# Altium schematic sheet Power.SchDoc
size A3; Author: Alptron AB; CompanyName: Alptron AB; DrawnBy: Caner Alp; Engineer: Caner Alp; Organization: Alptron AB; Address2: Vaesteas; Address4: Sweden; DocumentNumber: 3; SheetNumber: 3; SheetTotal: 5
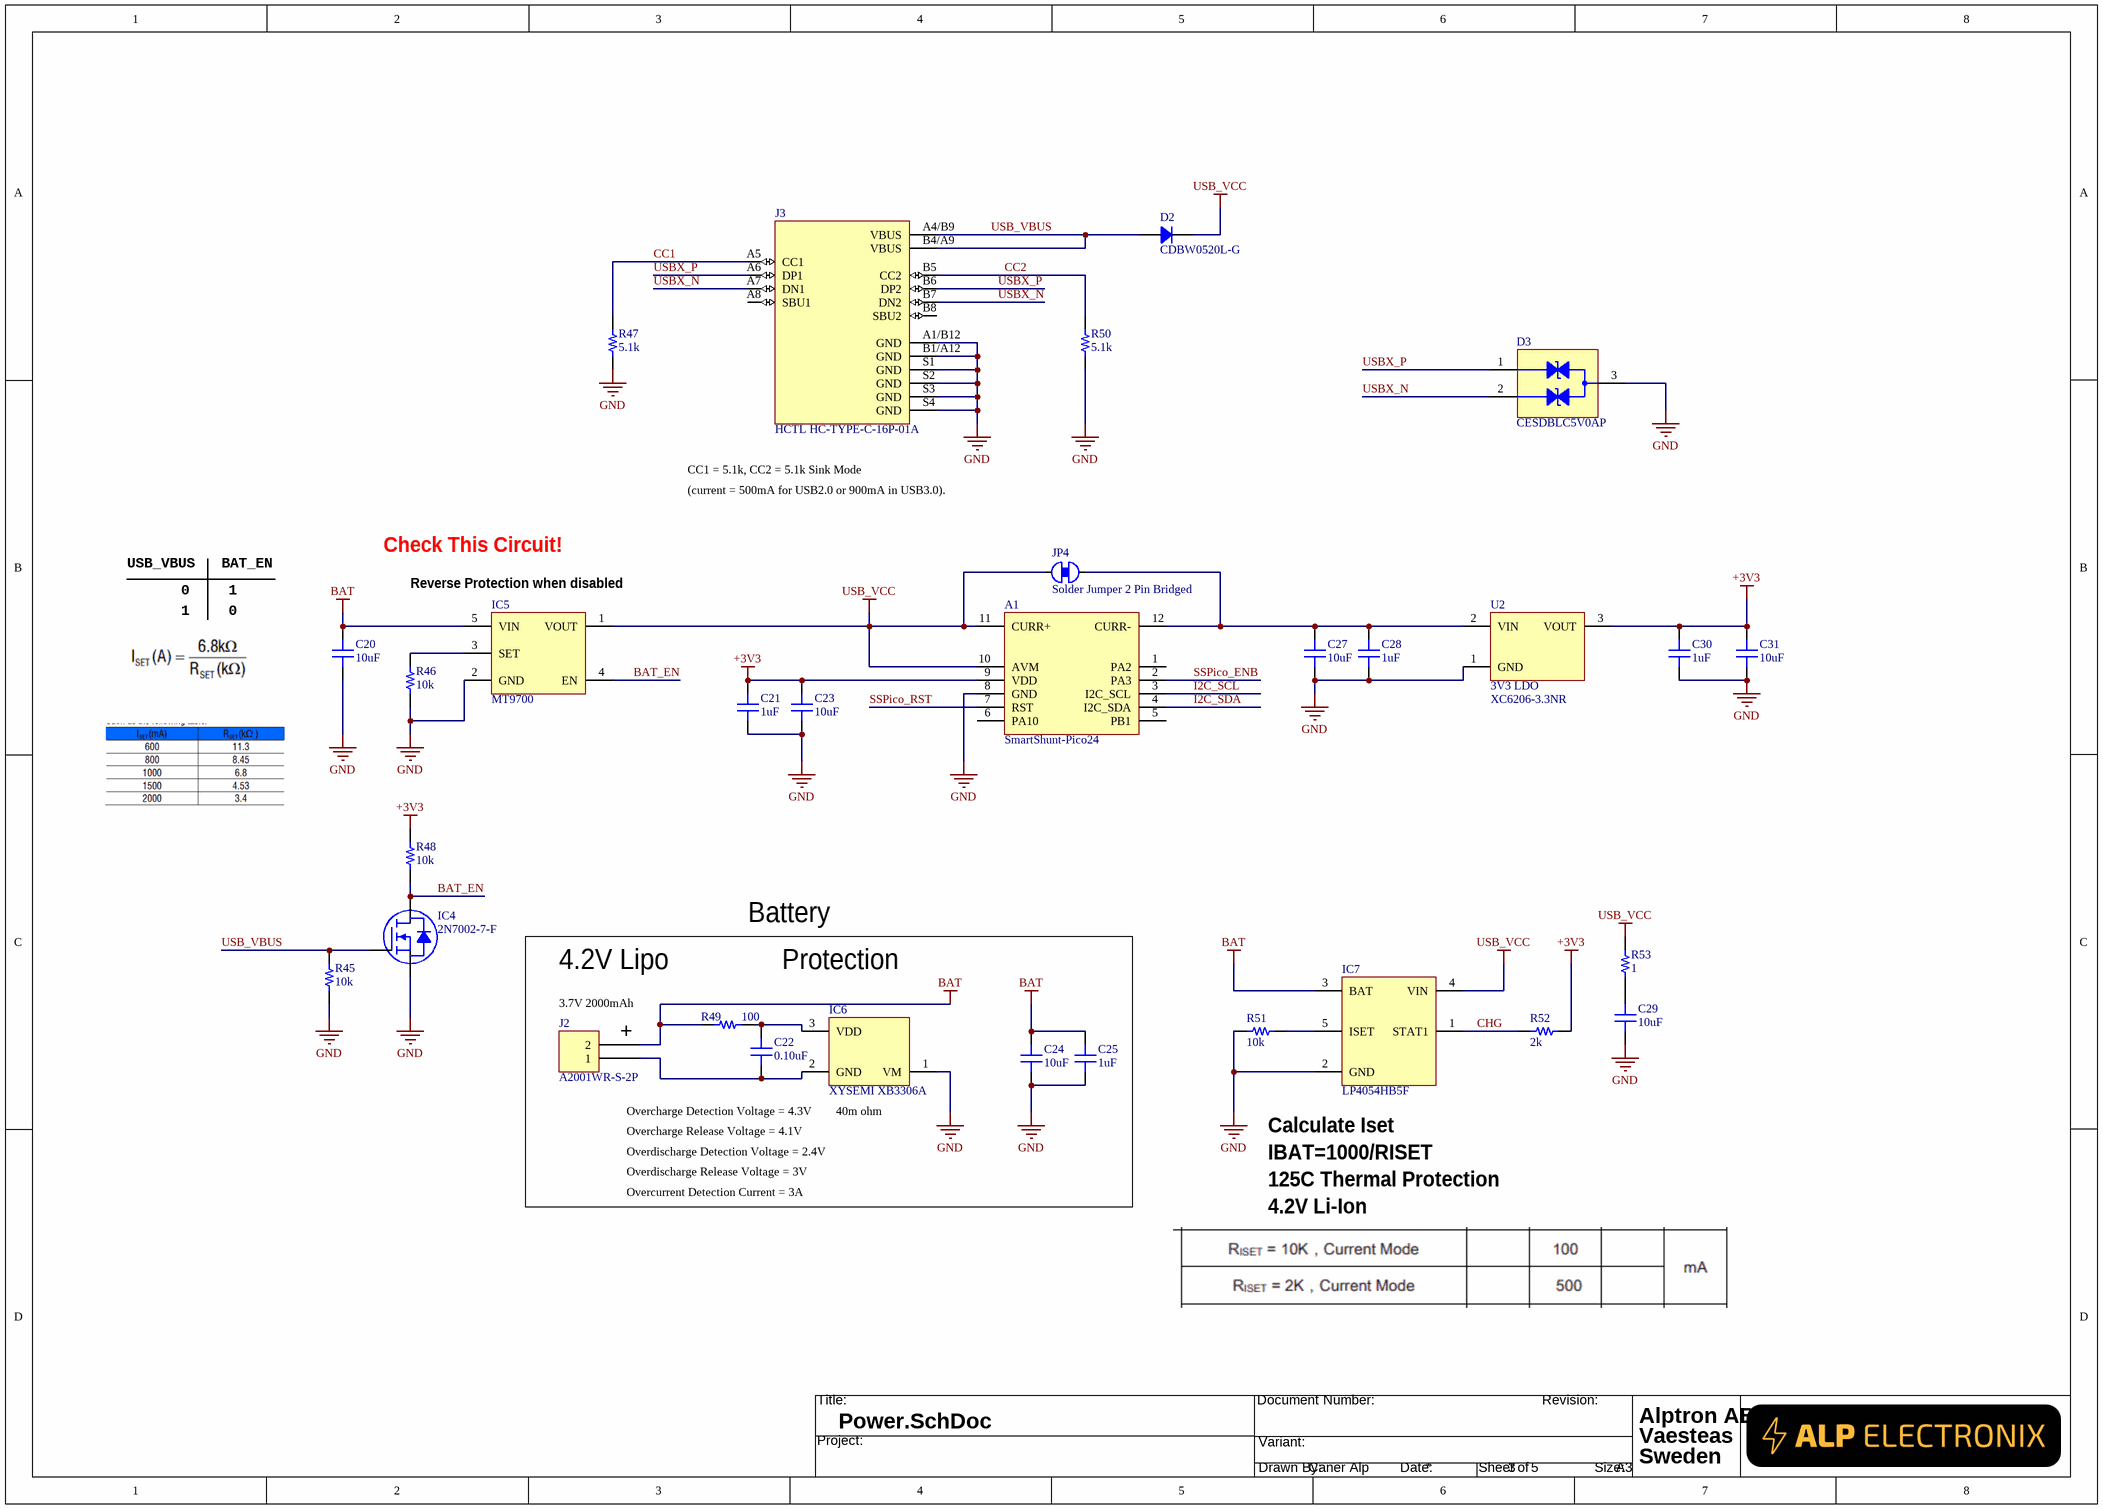
[diagram p0: Power.SchDoc]

## Parts
A1  SmartShunt-Pico24  [SmartShunt-Pico24]
C20  10uF  [CAP 0603/1608]
C21  1uF  [CAP 0402/1005]
C22  0.10uF  [CAP 0402/1005]
C23  10uF  [CAP 0603/1608]
C24  10uF  [CAP 0603/1608]
C25  1uF  [CAP 0402/1005]
C27  10uF  [CAP 0603/1608]
C28  1uF  [CAP 0402/1005]
C29  10uF  [CAP 0603/1608]
C30  1uF  [CAP 0402/1005]
C31  10uF  [CAP 0603/1608]
D2  CDBW0520L-G  [SOD-123]
D3  CESDBLC5V0AP  [ON SEMI SOT-23-3]
IC4  2N7002-7-F  [DIODES SOT-23-3]
IC5  MT9700  [DIODES SOT-23-5 W5]
IC6  XYSEMI XB3306A  [DIODES SOT-23-3]
IC7  LP4054HB5F  [DIODES SOT-23-5 W5]
J2  A2001WR-S-2P  [JST S2B-PH-SM4-TB]
J3  HCTL HC-TYPE-C-16P-01A  [HCTL HC-TYPE-C-16P-01A]
JP4  Solder Jumper 2 Pin Bridged  [SolderJumper-2_P1.3mm_Bridged_RoundedPad1.0x1.5mm]  (net tie, no BOM)
R45  10k  [RES 0402/1005]
R46  10k  [RES 0603/1608]
R47  5.1k  [RES 0402/1005]
R48  10k  [RES 0402/1005]
R49  100  [RES 0402/1005]
R50  5.1k  [RES 0402/1005]
R51  10k  [RES 0603/1608]
R52  2k  [RES 0402/1005]
R53  1  [RES 0402/1005]
U2  3V3 LDO  [DIODES SOT-23-3]

## Nets
+3V3: A1.9(VDD) C21.2 C23.2 C30.2 C31.2 R48.2 R52.2 U2.3(VOUT)
BAT: C20.2 C24.2 C25.2 IC5.5(VIN) IC7.3(BAT) J2.2 R49.1
GND: A1.8(GND) C20.1 C21.1 C23.1 C24.1 C25.1 C27.1 C28.1 C29.1 C30.1 C31.1 D3.3(I/O_2) IC4.3(S) IC5.2(GND) IC6.1(VM) IC7.2(GND) J3.A1/B12(GND) J3.B1/A12(GND) J3.S1(GND) J3.S2(GND) J3.S3(GND) J3.S4(GND) R45.1 R46.1 R47.1 R50.1 R51.1 U2.1(GND)
USB_VCC: A1.10(AVM) A1.11(CURR+) D2.2 IC5.1(VOUT) IC7.4(VIN) JP4.1(A) R53.2
BAT_EN: IC4.2(D) IC5.4(EN) R48.1
CC1: J3.A5(CC1) R47.2
CC2: J3.B5(CC2) R50.2
CHG: IC7.1(STAT1) R52.1
I2C_SCL: A1.3(I2C_SCL)
I2C_SDA: A1.4(I2C_SDA)
SSPico_ENB: A1.2(PA3)
SSPico_RST: A1.7(RST)
USB_VBUS: D2.1 IC4.1(G) J3.A4/B9(VBUS) J3.B4/A9(VBUS) R45.2
USBX_N: D3.2(GND) J3.A7(DN1) J3.B7(DN2)
USBX_P: D3.1(I/O_1) J3.A6(DP1) J3.B6(DP2)
NetA1_12: A1.12(CURR-) C27.2 C28.2 JP4.2(B) U2.2(VIN)
NetC22_1: C22.1 IC6.2(GND) J2.1
NetC22_2: C22.2 IC6.3(VDD) R49.2
NetC29_2: C29.2 R53.1
NetIC5_3: IC5.3(SET) R46.2
NetIC7_5: IC7.5(ISET) R51.2

Not connected (* = marked no-connect by the designer): A1 1(PA2) 5(PB1) 6(PA10); J3 A8(SBU1) B8(SBU2)

## Notes on the sheet
- (current = 500mA for USB2.0 or 900mA in USB3.0).
- CC1 = 5.1k, CC2 = 5.1k Sink Mode
- USB_VBUS
- BAT_EN
- Check This Circuit!
- (near IC5) Reverse Protection when disabled
- 0
- 1
- 4.2V Lipo
- Battery
- Protection
- (near J2) 3.7V 2000mAh
- (near J2) +
- Overcharge Detection Voltage = 4.3V
- (near IC6) 40m ohm
- Overdischarge Detection Voltage = 2.4V
- Overcharge Release Voltage = 4.1V
- Overdischarge Release Voltage = 3V
- (near IC7) Calculate Iset
- IBAT=1000/RISET
- 125C Thermal Protection
- Overcurrent Detection Current = 3A
- 4.2V Li-Ion
- Title:
- Project:
- Document Number:
- Variant:
- Revision:
- Drawn By:
- Date:
- Sheet
- of
- Size:
- A3

## Library data of the parts
A1 = SmartShunt-Pico24: Current Measurement Module
C20 C23 C24 C27 C29 C31 = GRM188R60J106ME47D: CAP CER 10UF 6.3V X5R 0603; Manufacturer: Murata Electronics North America; TemperatureRange: -55C ~ 85C; Tolerance: 20%; Value: 10uF; Part Number: GRM188R60J106ME47D; PartId: 12950; Supplier 1: Digi-Key; Supplier Part Number 1: 490-3896-2-ND; ComponentLink1Description: Datasheet; ComponentLink1URL: http://www.murata.com/~/media/webrenewal/support/library/catalog/products/capacitor/mlcc/c02e.pdf; ComponentLink2Description: Digi-Key Listing; ComponentLink2URL: https://www.digikey.com/product-detail/en/murata-electronics-north-america/GRM188R60J106ME47D/490-3896-2-ND/965910; TemperatureCoefficient: X5R; Voltage: 6.3V; Price: 0,031; Device Package: 0603 (1608 Metric)
C21 C25 C28 C30 = GRM155R70J105KA12D: CAP CER 1UF 6.3V X7R 0402; Manufacturer: Murata Electronics North America; TemperatureRange: -55C ~ 125C; Tolerance: 10%; Type: Derating Recommended; Value: 1uF; Part Number: GRM155R70J105KA12D; PartId: 5157; Supplier 1: Digi-Key; Supplier Part Number 1: 490-10024-2-ND; ComponentLink1Description: Datasheet; ComponentLink1URL: http://www.murata.com/~/media/webrenewal/support/library/catalog/products/capacitor/mlcc/c02e.ashx; ComponentLink2Description: Digi-Key listing; ComponentLink2URL: http://digikey.com/product-detail/en/GRM155R70J105KA12D/490-10024-2-ND/5027109; TemperatureCoefficient: X7R; Voltage: 6.3V; Price: 0,019; Device Package: 0402 (1005 Metric)
C22 = LMK105BJ104KV-F: CAP CER 0.1UF 10V X5R 0402; Manufacturer: Taiyo Yuden; TemperatureRange: -55C ~ 85C; Tolerance: 10%; Value: 0.10uF; Part Number: LMK105BJ104KV-F; PartId: 12322; Supplier 1: Digi-Key; Supplier Part Number 1: 587-1227-2-ND; ComponentLink1Description: Datasheet; ComponentLink1URL: http://ds.yuden.co.jp/TYCOMPAS/ut/detail.do?productNo=LMK105BJ104KV-F&fileName=LMK105BJ104KV-F_SS&mode=specSheetDownload; ComponentLink2Description: Digi-Key Listing; ComponentLink2URL: https://www.digikey.com/product-detail/en/taiyo-yuden/LMK105BJ104KV-F/587-1227-2-ND/930579; TemperatureCoefficient: X5R; Voltage: 10V; Price: 0,0021; Device Package: 0402 (1005 Metric)
D2 = CDBW0520L-G: DIODE SCHOTTKY 20V 500MA SOD123; Manufacturer: Comchip Technology; Current - Reverse Leakage @ Vr: 250 µA @ 20 V; Speed: Fast Recovery =< 500ns, > 200mA (Io); Voltage - Forward (Vf) (Max) @ If: 385 mV @ 500 mA; Part Number: CDBW0520L-G; ComponentLink1Description: Datasheet; ComponentLink1URL: http://www.comchiptech.com/admin/files/product/CDBW0520L-HF Thru824572. CDBW0540-HF RevA.pdf; ComponentLink2Description: DigiKey Link; ComponentLink2URL: https://www.digikey.com/en/products/detail/comchip-technology/CDBW0520L-G/1979670; Current - Average Rectified (Io): 500mA; Diode Type: Schottky; LastUpdated: 2022-06-30 22:48:20; Lifecycle Status: Active; Minimum Order: 1; Mounting Type: Surface Mount; Operating Temperature - Junction: 125°C (Max); Package / Case: SOD-123; Packaging: TapeAndReel; PartId: 2251; Part Status: Active; Price: 0.07; Series: -; Supplier 1: DigiKey; Supplier Part Number 1: 641-1326-1-ND; Supplier Device Package: SOD-123; Voltage - DC Reverse (Vr) (Max): 20 V
D3 = NUP2105LT1G: TVS DIODE 24V 44V SOT23-3; Manufacturer: ON Semiconductor; Bidirectional Channels: 2; Capacitance @ Frequency: 30pF @ 1MHz; Current - Peak Pulse (10/1000µs): 8A (8/20µs); Power Line Protection: No; Power - Peak Pulse: 350W; Type: Zener; Voltage - Breakdown (Min): 26.2V; Voltage - Reverse Standoff (Typ): 24V (Min); Part Number: CESDBLC5V0AP; Applications: General Purpose; ComponentLink1Description: Datasheet; ComponentLink1URL: http://www.onsemi.com/pub/Collateral/NUP2105L-D.PDF; ComponentLink2Description: DigiKey Link; ComponentLink2URL: http://digikey.com/product-detail/en/on-semiconductor/NUP2105LT1G/NUP2105LT1GOSCT-ND/1485001; Device Package: TO-236-3, SC-59, SOT-23-3; LastUpdated: 2020-03-30 16:33:57; Lifecycle Status: Active; Minimum Order: 1; Mounting Type: Surface Mount; Operating Temperature: -55°C ~ 150°C (TJ); Package / Case: TO-236-3, SC-59, SOT-23-3; Packaging: TapeAndReel; PartId: 10506; Part Status: Active; Price: 0.09; Series: -; Supplier 1: DigiKey; Supplier Part Number 1: NUP2105LT1GOSCT-ND; Supplier Device Package: SOT-23-3 (TO-236); Voltage - Clamping (Max) @ Ipp: 44V
IC4 = 2N7002-7-F: MOSFET N-CH 60V 115MA SOT23-3; Manufacturer: Diodes Incorporated; Rds On (Max) at Id, Vgs: 7.5 Ohm @ 50mA, 5V; Vgs(th) (Max) at Id: 2.5V @ 250uA; Input Capacitance (Ciss) at Vds: 50pF @ 25V; Power - Max: 370mW; Current Continuous Drain: 115mA (Ta); Part Number: 2N7002-7-F; PartId: 7967; Supplier 1: Digi-Key; Supplier Part Number 1: 2N7002-FDITR-ND; ComponentLink1Description: Datasheet; ComponentLink1URL: http://www.diodes.com/_files/datasheets/ds11303.pdf; ComponentLink2Description: Digi-Key Listing; ComponentLink2URL: http://www.digikey.com/product-detail/en/2N7002-7-F/2N7002-FDITR-ND/717681; Price: 0,0255; Type: MOSFET N-Channel, Metal Oxide; Device Package: TO-236-3, SC-59, SOT-23-3; Gate Charge (Qg): -; Drain to Source Voltage (Vdss): 60V; Features: Standard
IC5 = MT9700: SOT-23-5 Power Distribution Switches ROHS
IC6 = XYSEMI XB3306A: IC LITHIUM BATT PROTECT SOT23-3; Function: Protection; Battery Chemistry: Li-Ion, Li-Pol; Part Number: XYSEMI XB3306A; PartId: 16446; Manufacturer: XYSEMI; Supplier 1: LCSC; Supplier Part Number 1: C154939; ComponentLink1Description: Datasheet; ComponentLink1URL: http://www.baitaishengshi.com/uploadfile/2017/1213/20171213368970.pdf; ComponentLink2Description: LCSC Listing; ComponentLink2URL: https://lcsc.com/product-detail/Battery-Protection-ICs_XB3306A_C154939.html; Device Package: SOT-23-3
IC7 = LP4054HB5F: 600mA Standalone Linear Li-Ion Battery Charger
J2 = S2B-PH-SM4-TB(LF)(SN): CONN HEADER SMD R/A 2POS 2MM; Manufacturer: JST Sales America Inc.; Contact Length - Mating: 0.130" (3.30mm); Current Rating (Amps): 2A; Material Flammability Rating: UL94 V-0; Number of Positions: 2; Number of Positions Loaded: All; Pitch - Mating: 0.079" (2.00mm); Shrouding: Shrouded - 4 Wall; Style: Board to Cable/Wire; Voltage Rating: 100V; Part Number: S2B-PH-SM4-TB(LF)(SN); ComponentLink1Description: Datasheet; ComponentLink1URL: http://www.jst-mfg.com/product/pdf/eng/ePH.pdf; ComponentLink2Description: DigiKey Link; ComponentLink2URL: http://digikey.com/product-detail/en/jst-sales-america-inc/S2B-PH-SM4-TB-LF-SN/455-1749-1-ND/926846; Connector Type: Header; Contact Finish - Mating: Tin; Contact Finish - Post: Tin; Contact Material: Copper Alloy; Contact Shape: Square; Contact Type: Male Pin; Fastening Type: Detent Lock; Features: Solder Retention; Insulation Color: Natural; Insulation Height: 0.217" (5.51mm); Insulation Material: Polyamide (PA6T), Nylon 6T; LastUpdated: 2020-01-15 03:45:11; Lifecycle Status: Active; Minimum Order: 1; Mounting Type: Surface Mount, Right Angle; Number of Rows: 1; Operating Temperature: -25°C ~ 85°C; Packaging: TapeAndReel; PartId: 115; Part Status: Active; Price: 0.27; Series: PH; Supplier 1: DigiKey; Supplier Part Number 1: 455-1749-1-ND; Termination: Solder
J3 = HIRO TYPE-C-31-M-12: CONN USB 2.0 TYPE-C R/A SMT; Manufacturer: Hiro; Number Of Positions: 12; Part Number: HCTL HC-TYPE-C-16P-01A; PartId: 9703; Supplier 1: LCSC; Supplier Part Number 1: C165948; ComponentLink1Description: Datasheet; ComponentLink1URL: https://datasheet.lcsc.com/szlcsc/1811131825_Korean-Hroparts-Elec-TYPE-C-31-M-12_C165948.pdf; ComponentLink2Description: LCSC Listing; ComponentLink2URL: https://lcsc.com/product-detail/USB-Type-C_Korean-Hroparts-Elec-TYPE-C-31-M-12_C165948.html; Type: USB - C; Series: USB 3.0
JP4 = SolderJumper_2_Bridged: ki_keywords: solder jumper SPST; ki_description: Solder Jumper, 2-pole, closed/bridged; ki_fp_filters: SolderJumper*Bridged*; Supplier: ~
R45 R48 = RC0402JR-0710KL: RES SMD 10K OHM 5% 1/16W 0402; Manufacturer: Yageo; TemperatureRange: -55C ~ 155C; TemperatureCoefficient: 100ppm/C; PowerRating: 0.063W, 1/16W; Value: 10k; Part Number: RC0402JR-0710KL; PartId: 14464; Supplier 1: Digi-Key; Supplier Part Number 1: 311-10KJRTR-ND; ComponentLink1Description: Datasheet; ComponentLink1URL: http://www.yageo.com/documents/recent/PYu-RC_Group_51_RoHS_L_04.pdf; ComponentLink2Description: Digi-Key Listing; ComponentLink2URL: https://www.digikey.com/product-detail/en/yageo/RC0402JR-0710KL/311-10KJRTR-ND/726418; Tolerance: 5%; Price: 0,0017; Device Package: 0402 (1005 Metric)
R46 R51 = ERJ-3GEYJ103V: RES SMD 10K OHM 5% 1/10W 0603; Manufacturer: Panasonic Electronic Components; TemperatureRange: -55C ~ 155C; TemperatureCoefficient: 200ppm/C; PowerRating: 0.1W, 1/10W; Value: 10k; Part Number: ERJ-3GEYJ103V; PartId: 11175; Supplier 1: Digi-Key; Supplier Part Number 1: P10KGTR-ND; ComponentLink1Description: Datasheet; ComponentLink1URL: http://industrial.panasonic.com/www-cgi/jvcr13pz.cgi?E+PZ+3+AOA0001+ERJ3GEYJ103V+7+WW; ComponentLink2Description: Digi-Key Listing; ComponentLink2URL: https://www.digikey.com/product-detail/en/panasonic-electronic-components/ERJ-3GEYJ103V/P10KGTR-ND/135662; Tolerance: 5%; Price: 0,002; Device Package: 0603 (1608 Metric)
R47 R50 = RC0402JR-075K1L: RES SMD 5.1K OHM 5% 1/16W 0402; Manufacturer: Yageo; TemperatureRange: -55C ~ 155C; TemperatureCoefficient: 100ppm/C; PowerRating: 0.063W, 1/16W; Value: 5.1k; Part Number: RC0402JR-075K1L; PartId: 14528; Supplier 1: Digi-Key; Supplier Part Number 1: 311-5.1KJRTR-ND; ComponentLink1Description: Datasheet; ComponentLink1URL: http://www.yageo.com/documents/recent/PYu-RC_Group_51_RoHS_L_04.pdf; ComponentLink2Description: Digi-Key Listing; ComponentLink2URL: https://www.digikey.com/product-detail/en/yageo/RC0402JR-075K1L/311-5.1KJRTR-ND/726487; Tolerance: 5%; Price: 0,0017; Device Package: 0402 (1005 Metric)
R49 = RC0402JR-07100RL: RES SMD 100 OHM 5% 1/16W 0402; Manufacturer: Yageo; TemperatureRange: -55C ~ 155C; TemperatureCoefficient: 100ppm/C; PowerRating: 0.063W, 1/16W; Value: 100; Part Number: RC0402JR-07100RL; PartId: 14478; Supplier 1: Digi-Key; Supplier Part Number 1: 311-100JRTR-ND; ComponentLink1Description: Datasheet; ComponentLink1URL: http://www.yageo.com/documents/recent/PYu-RC_Group_51_RoHS_L_04.pdf; ComponentLink2Description: Digi-Key Listing; ComponentLink2URL: https://www.digikey.com/product-detail/en/yageo/RC0402JR-07100RL/311-100JRTR-ND/726415; Tolerance: 5%; Price: 0,0017; Device Package: 0402 (1005 Metric)
R52 = RC0402JR-072KL: RES SMD 2K OHM 5% 1/16W 0402; Manufacturer: Yageo; TemperatureRange: -55C ~ 155C; TemperatureCoefficient: 100ppm/C; PowerRating: 0.063W, 1/16W; Value: 2k; Part Number: RC0402JR-072KL; PartId: 14511; Supplier 1: Digi-Key; Supplier Part Number 1: 311-2.0KJRTR-ND; ComponentLink1Description: Datasheet; ComponentLink1URL: http://www.yageo.com/documents/recent/PYu-RC_Group_51_RoHS_L_04.pdf; ComponentLink2Description: Digi-Key Listing; ComponentLink2URL: https://www.digikey.com/product-detail/en/yageo/RC0402JR-072KL/311-2.0KJRTR-ND/726434; Tolerance: 5%; Price: 0,0017; Device Package: 0402 (1005 Metric)
R53 = RC0402JR-071RL: RES SMD 1 OHM 5% 1/16W 0402; Manufacturer: Yageo; TemperatureRange: -55C ~ 155C; TemperatureCoefficient: 200ppm/C; PowerRating: 0.063W, 1/16W; Value: 1; Part Number: RC0402JR-071RL; PartId: 14504; Supplier 1: Digi-Key; Supplier Part Number 1: 311-1.0JRTR-ND; ComponentLink1Description: Datasheet; ComponentLink1URL: http://www.yageo.com/documents/recent/PYu-RC_Group_51_RoHS_L_04.pdf; ComponentLink2Description: Digi-Key Listing; ComponentLink2URL: https://www.digikey.com/product-detail/en/yageo/RC0402JR-071RL/311-1.0JRTR-ND/726407; Tolerance: 5%; Price: 0,0017; Device Package: 0402 (1005 Metric)
U2 = XC6206-3.3NR: MPN: XC6206-3.3NR